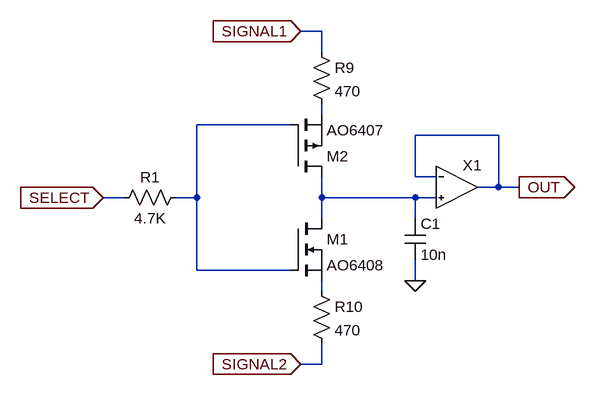
[diagram p0: schematic switch2_0.1v.asc]
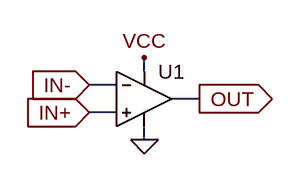
[diagram p1: sub-circuit opamp.asc]
switch2_0.1v.asc, the LTspice schematic file:
Version 4
SHEET 1 1676 680
WIRE 592 -64 560 -64
WIRE 592 -32 592 -64
WIRE 592 64 592 48
WIRE 544 80 400 80
WIRE 864 96 736 96
WIRE 736 160 736 96
WIRE 768 160 736 160
WIRE 864 176 864 96
WIRE 864 176 832 176
WIRE 896 176 864 176
WIRE 288 192 256 192
WIRE 400 192 400 80
WIRE 400 192 368 192
WIRE 592 192 592 160
WIRE 736 192 592 192
WIRE 768 192 736 192
WIRE 592 224 592 192
WIRE 736 224 736 192
WIRE 400 304 400 192
WIRE 544 304 400 304
WIRE 736 320 736 288
WIRE 592 336 592 320
WIRE 592 448 592 416
WIRE 592 448 560 448
FLAG 560 -64 SIGNAL1
IOPIN 560 -64 In
FLAG 560 448 SIGNAL2
IOPIN 560 448 In
FLAG 256 192 SELECT
IOPIN 256 192 In
FLAG 896 176 OUT
IOPIN 896 176 Out
FLAG 736 320 0
SYMBOL nmos 544 224 R0
SYMATTR InstName M1
SYMATTR Value AO6408
SYMBOL pmos 544 160 M180
SYMATTR InstName M2
SYMATTR Value AO6407
SYMBOL cap 720 288 M180
WINDOW 0 24 56 Left 2
WINDOW 3 24 8 Left 2
SYMATTR InstName C1
SYMATTR Value 10n
SYMBOL res 576 -48 R0
SYMATTR InstName R9
SYMATTR Value 470
SYMBOL res 576 320 R0
SYMATTR InstName R10
SYMATTR Value 470
SYMBOL opamp 800 176 R0
WINDOW 0 9 -34 Left 2
SYMATTR InstName X1
SYMBOL res 384 176 R90
WINDOW 0 0 56 VBottom 2
WINDOW 3 32 56 VTop 2
SYMATTR InstName R1
SYMATTR Value 4.7K

opamp.asc, the sub-circuit schematic file:
Version 4
SHEET 1 880 680
WIRE 144 144 144 128
WIRE 112 160 80 160
WIRE 208 176 176 176
WIRE 112 192 80 192
WIRE 144 224 144 208
FLAG 144 224 0
FLAG 144 128 VCC
FLAG 208 176 OUT
IOPIN 208 176 Out
FLAG 80 192 IN+
IOPIN 80 192 In
FLAG 80 160 IN-
IOPIN 80 160 In
SYMBOL Opamps\\UniversalOpamp2 144 176 R0
SYMATTR InstName U1
SYMATTR Value2 Avol=1Meg GBW=1.2Meg Slew=10Meg

The netlist it stands for:
* switch2_0.1v.asc
M1 N003 N002 N004 N004 AO6408
M2 N003 N002 N001 N001 AO6407
C1 0 N003 10n
R9 SIGNAL1 N001 470
R10 N004 SIGNAL2 470
XX1 N003 OUT OUT opamp
R1 N002 SELECT 4.7K

* block symbol definitions
.subckt opamp IN+ IN- OUT
XU1 IN+ IN- VCC 0 OUT level.2 Avol=1Meg GBW=1.2Meg Slew=10Meg ilimit=25m rail=0 Vos=0 phimargin=45 en=0 enk=0 in=0 ink=0 Rin=500Meg  ; pins IN+ IN- V+ V- OUT
.ends opamp

.model NMOS NMOS
.model PMOS PMOS
.lib standard.mos
.lib UniversalOpamps2.sub
.backanno
.end